# EasyEDA Pro project stm32_basic_extender.epro.epro

# Schematic Schematic1
Board Name: Board1; Create Date: 2024-08-31; Page Size: A3
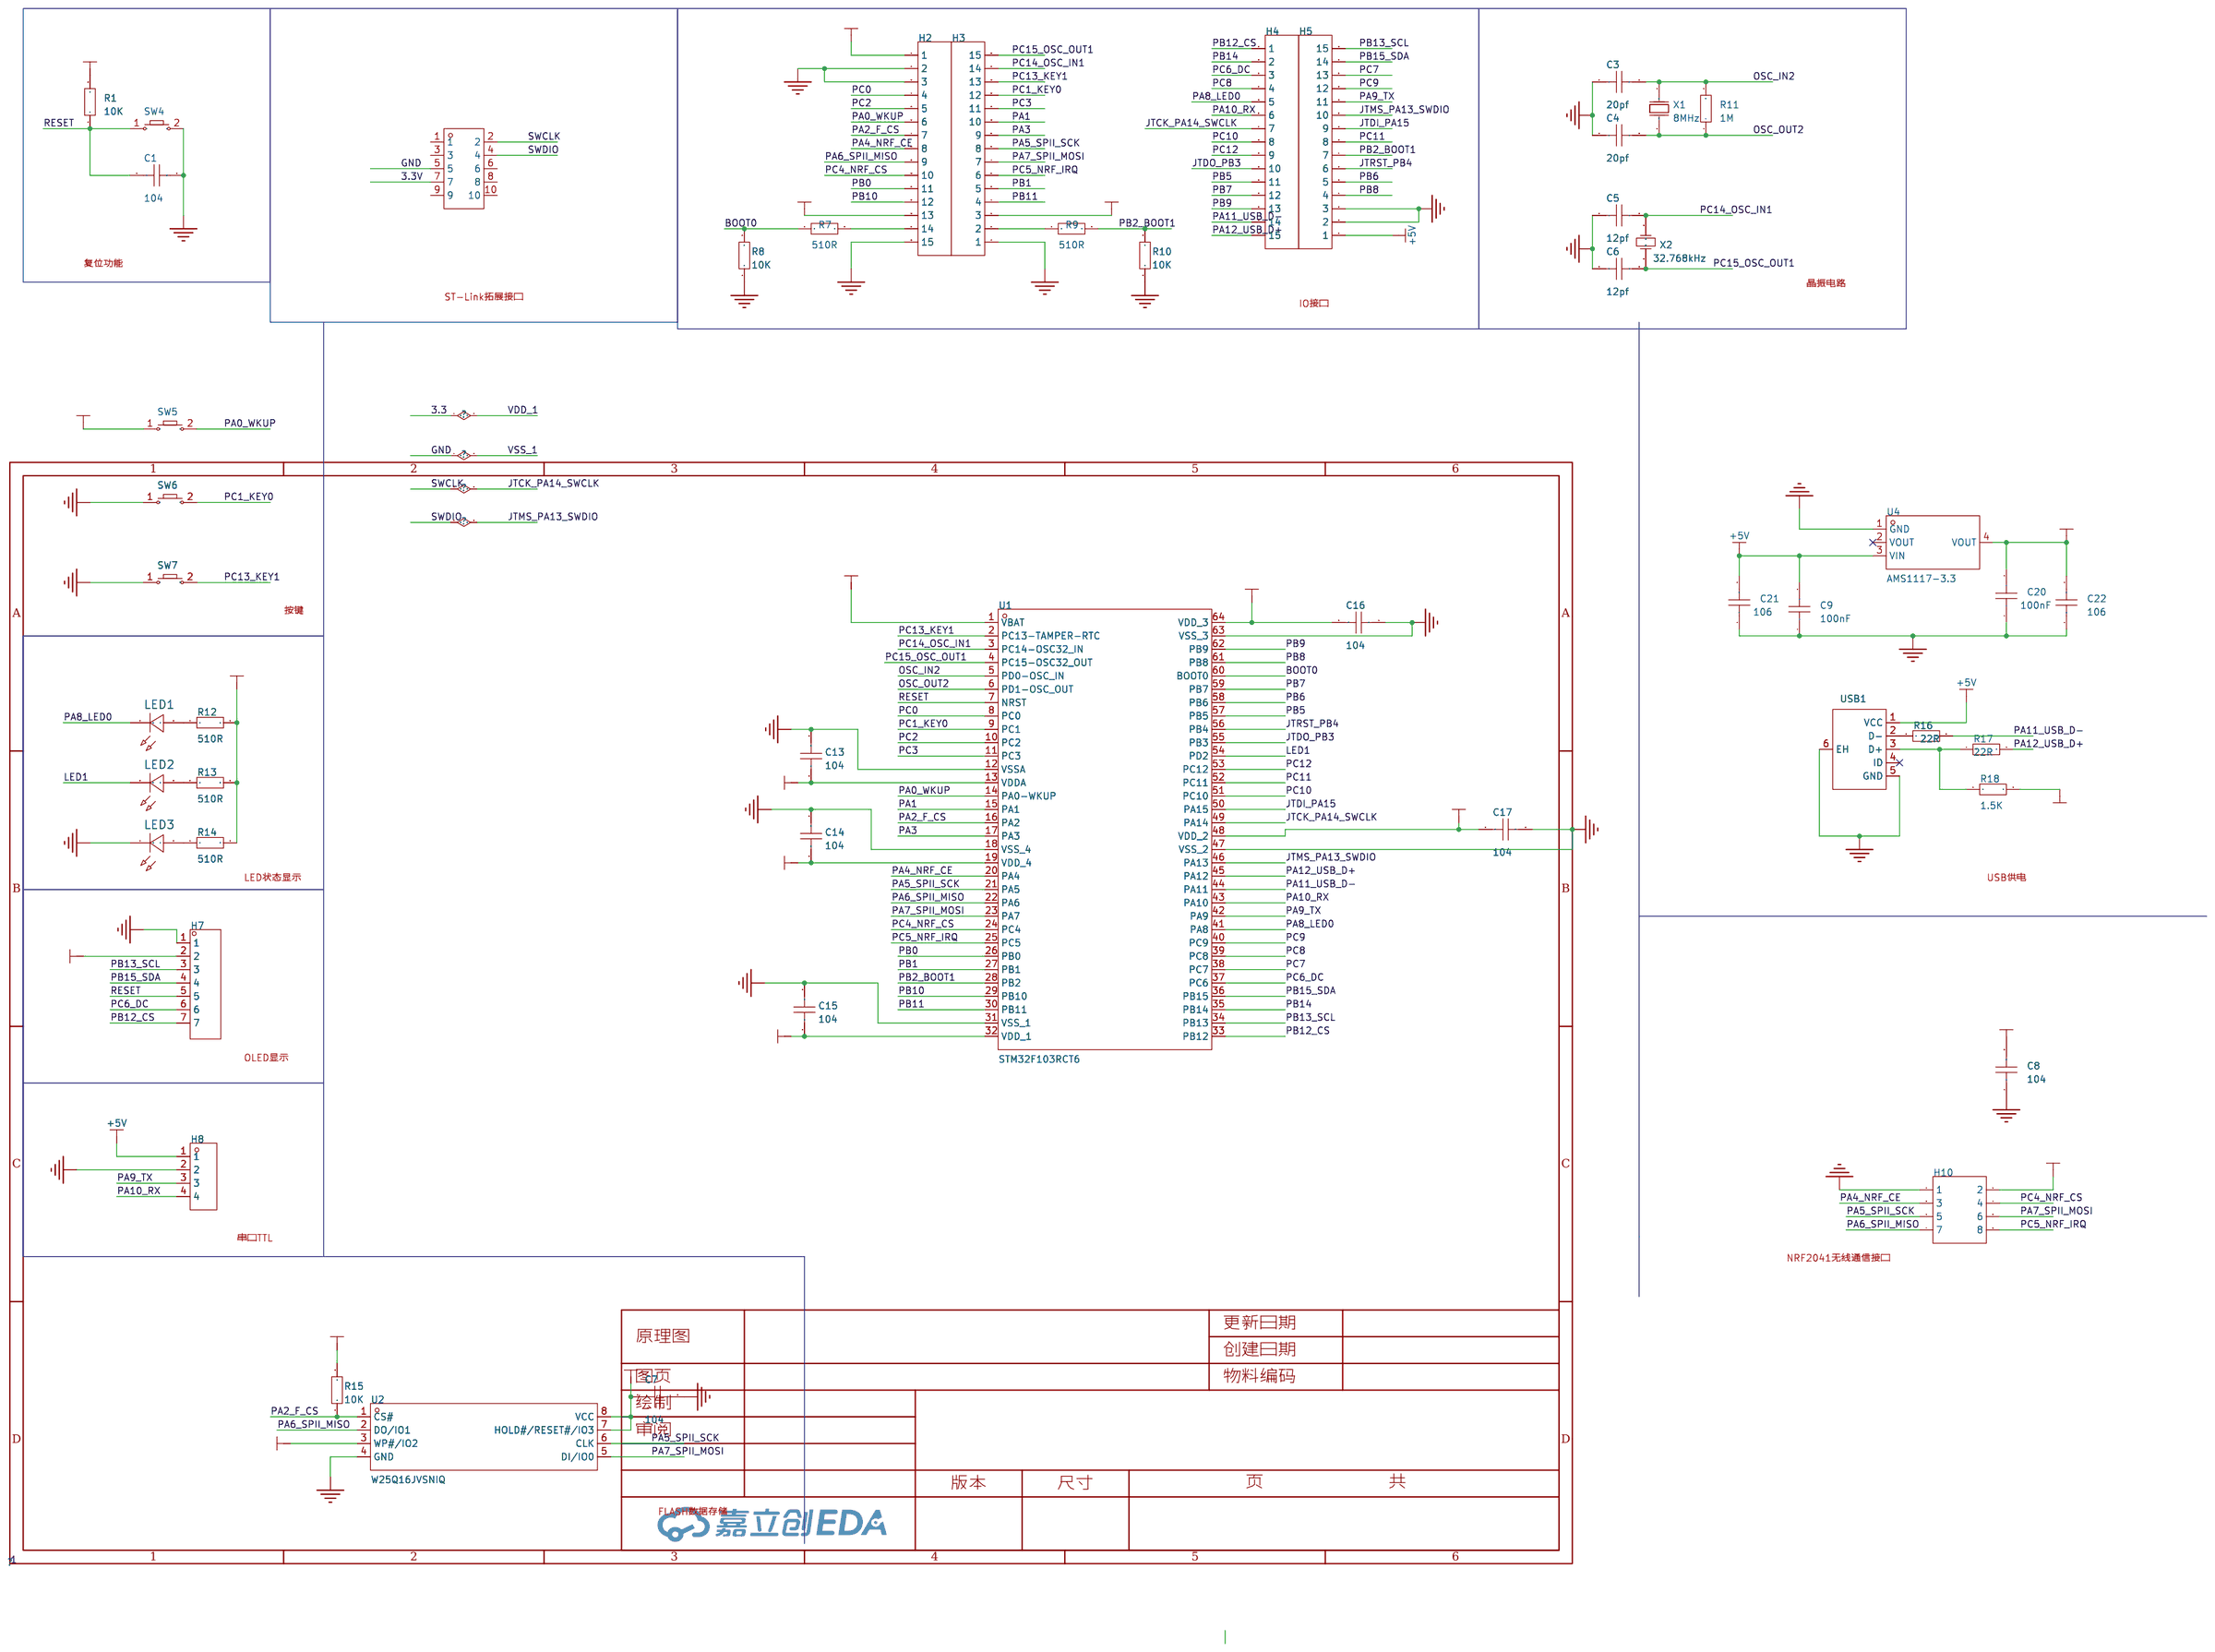
[diagram p0: schematic sheet]

## Parts
C1  104  [C0603]
C3  20pf  [C0603]
C4  20pf  [C0603]
C5  12pf  [C0603]
C6  12pf  [C0603]
C7  104  [C0603]
C8  104  [C0603]
C9  100nF  [C0603]
C13  104  [C0603]
C14  104  [C0603]
C15  104  [C0603]
C16  104  [C0603]
C17  104  [C0603]
C20  100nF  [C0603]
C21  106  [C0805]
C22  106  [C0805]
H2  -  [HDR-TH_15P-P2.54-V-F-1]
H3  -  [HDR-TH_15P-P2.54-V-F-1]
H4  -  [HDR-TH_15P-P2.54-V-F-1]
H5  -  [HDR-TH_15P-P2.54-V-F-1]
H7  -  [HDR-TH_7P-P2.54-V-F]
H8  -  [HDR-TH_4P-P2.54-V-F]
H10  -  [HDR-TH_8P-P2.54-V-F-R2-C4-S2.54-1]
LED1  -  [LED_0603]
LED2  -  [LED_0603]
LED3  -  [LED_0603]
R1  10K  [R0603]
R7  510R  [R0603]
R8  10K  [R0603]
R9  510R  [R0603]
R10  10K  [R0603]
R11  1M  [R0603]
R12  510R  [R0603]
R13  510R  [R0603]
R14  510R  [R0603]
R15  10K  [R0603]
R16  22R  [R0603]
R17  22R  [R0603]
R18  1.5K  [R0603]
SW4  -  [Key_SMD_3.6x6.1x2.5]
SW5  -  [Key_SMD_3.6x6.1x2.5]
SW6  -  [Key_SMD_3.6x6.1x2.5]
SW7  -  [Key_SMD_3.6x6.1x2.5]
U1  STM32F103RCT6  [LQFP-64_L10.0-W10.0-P0.50-LS12.0-BL]
U2  W25Q16JVSNIQ  [SOIC-8_L5.2-W5.2-P1.27-LS7.9-BL]
U4  AMS1117-3.3  [SOT-223-3_L6.5-W3.4-P2.30-LS7.0-BR]
U5  2.54-2*5  [HDR-TH_10P-P2.54-V-F-R2-C5-S2.54]
USB1  -  [USB_Micro]
X1  8MHz  [OSC-TH_L10.0-W4.5-P5.00]
X2  32.768kHz  [OSC-TH_BD3.1-P0.8-D0.3]

## Library data of the parts
C1 C3-C9 C13-C17 C20 = CAP_0603: Supplier Footprint: 0603
C21 C22 = CAP_0805: Supplier Footprint: 0805
H2-H5 = HDR-F_2.54_1x15P: Supplier Part: C124408; Supplier Footprint: 插件,
H7 = HDR-F_2.54_1x7P: Supplier Part: C124418; Supplier Footprint: 插件
H8 = HDR-F_2.54_1x4P: Supplier Part: C2718488; Supplier Footprint: 插件
H10 = HDR-F_2.54_2x4: Supplier Part: C92271; Supplier Footprint: 插件
LED1-LED3 = LED_0603-R: Supplier Footprint: 0603
R1 R7-R18 = Res_0603: Supplier Footprint: 0603
SW4-SW7 = Key_SMD_3.6x6.1x2.5: Supplier Footprint: SMD
U1 = STM32F103RCT6: CPU内核:ARM-M3;程序存储容量:256KB;RAM总容量:48KB;GPIO端口数量:51;工作电压范围:2V~3.6V;CPU最大主频:72MHz;程序存储器类型:FLASH;; LCSC Part Name: 主流增强型ARM Cortex-M3 MCU，具有256 KB Flash、72 MHz CPU、电机控制、USB和CAN; Supplier Part: C8323; Manufacturer: ST(意法半导体); Supplier Footprint: LQFP-64(10x10); JLCPCB Part Class: 扩展库; Datasheet: https://atta.szlcsc.com/upload/public/pdf/source/20180207/C88442_15179953708671359491.pdf; Supplier: LCSC; CPU Core: ARM-M3; Program Storage Size: 256KB; RAM Size: 48KB; GPIO Ports Number: 51; Operating Voltage Range: 2V~3.6V; CPU Maximum Speed: 72MHz; Program Memory Type: FLASH; Operating Temperature Range: -40℃~+85℃; ADC (Bit): 12bit; DAC (Bit): 12bit; Universal Serial Bus: 有; Peripheral/Function: DMA；温度传感器；PWM; Watchdog: 有; Infrared Data Association: 有; Low-Voltage Detect: 有; Direct Memory Access: 有; Internal Oscillator: 有; EEPROM: 256KB
U2 = W25Q16JVSNIQ_C2456211: Supplier Part: C2456211; Manufacturer: WINBOND(华邦); Supplier Footprint: SOIC-8; JLCPCB Part Class: Extended Part; Datasheet: https://atta.szlcsc.com/upload/public/pdf/source/20190529/C115407_78E5B4F96E7138D299EC51EC5982A1A5.pdf; Supplier: LCSC
U4 = AMS1117-3.3_C6186: 输出类型:固定;输出极性:正;最大输入电压:-;输出电压:3.3V;输出电流:1A;电源纹波抑制比(PSRR):72dB@(120Hz);; LCSC Part Name: 输出3.3V 1A; Supplier Part: C6186; Manufacturer: AMS; Supplier Footprint: SOT-223; JLCPCB Part Class: 基础库; Datasheet: https://atta.szlcsc.com/upload/public/pdf/source/20180727/C6186_7A095716F0823C02F1997A905E26C086.pdf; Supplier: LCSC; Output Type: 固定; Output Polarity: 正; Number of Outputs: 1; Output Voltage: 3.3V; Dropout Voltage: 1.3V@(800mA); Output Current: 1A; Power Supply Rejection Ratio (PSRR): 72dB@(120Hz)
U5 = 2.54-2*5: 插孔结构:2x5P;间距:2.54mm;行距:2.54mm;圆孔/方孔:方孔;安装类型:直插;排数:双排;总孔位数:10P;额定电流:2.5A;额定电压:-;插孔方向:顶部;塑高:8.5mm;工作温度范围:-40℃~+105℃;; LCSC Part Name: 间距:2.54mm 2x5P 直插; Supplier Part: C2977587; Manufacturer: ZHOURI(洲日); Supplier Footprint: 插件,P=2.54mm; JLCPCB Part Class: 扩展库; Datasheet: https://atta.szlcsc.com/upload/public/pdf/source/20220328/53961E697C4FF664B69BABFADEC8B830.pdf; Supplier: LCSC; Holes Structure: 2x5P; Pitch: 2.54mm; Row Spacing: 2.54mm; Circular Hole / Square Hole: 方孔; Mounting Type: 直插; Number of Rows: 双排; Number of Holes: 10P; Current Rating (Max): 2.5A; Holes Direction: 顶部; Insulation Height: 8.5mm; Operating Temperature Range: -40℃~+105℃
USB1 = USB_Micro-B: Supplier Footprint: SMD
X1 = X49SD8MSD2SC: 频率:8MHz;频率公差:±20ppm;负载电容:20pF;; LCSC Part Name: 8MHz ±20ppm 20pF HC-49US; Supplier Part: C21263; Manufacturer: YXC(扬兴晶振); Supplier Footprint: HC-49S; JLCPCB Part Class: Extended Part; Datasheet: https://atta.szlcsc.com/upload/public/pdf/source/20210903/A997D130AE99CBB55D9024F9BE6DA174.pdf; Supplier: LCSC; Crystal Type: 49S晶振; Frequency Tolerance: ±20ppm; Frequency Stability: ±30ppm; Load Capacitance: 20pF; Operating Temperature: -20℃~+70℃
X2 = X308032768KGB2SC: 频率:32.768kHz;频率公差:±10ppm;负载电容:12.5pF;; LCSC Part Name: 32.768kHz ±10ppm 12.5pF YT-38; Supplier Part: C52082; Manufacturer: YXC(扬兴晶振); Supplier Footprint: DT-38; JLCPCB Part Class: Extended Part; Datasheet: https://atta.szlcsc.com/upload/public/pdf/source/20210729/394323D37097DADF5DA3ECA9C1DCF4BF.pdf; Supplier: LCSC; Crystal Type: 圆柱体晶振; Frequency Tolerance: ±10ppm; Load Capacitance: 12.5pF; Operating Temperature: -20℃~+70℃

## Nets
3.3V: U5.7
+5V: C9.2 C21.2 H5.1 H8.1 U4.3(VIN) USB1.1(VCC)
GND: C1.2 C3.1 C4.1 C5.1 C6.1 C7.2 C8.1 C9.1 C13.2 C14.2 C15.2 C16.1 C17.1 C20.1 C21.1 C22.1 H2.2 H2.3 H2.15 H3.1 H5.2 H5.3 H7.1 H8.2 H10.1 LED3.1(C) R8.1 R10.1 SW4.2 SW6.1 SW7.1 U1.12(VSSA) U1.18(VSS_4) U1.31(VSS_1) U1.47(VSS_2) U1.63(VSS_3) U2.4(GND) U4.1(GND) U5.5 USB1.5(GND) USB1.6(EH)
VCC3V3: C7.1 C8.2 C13.1 C14.1 C15.1 C16.2 C17.2 C20.2 C22.2 H2.1 H2.13 H3.3 H7.2 H10.2 R1.2 R12.2 R13.2 R14.2 R15.2 R18.2 SW5.1 U1.1(VBAT) U1.13(VDDA) U1.19(VDD_4) U1.32(VDD_1) U1.48(VDD_2) U1.64(VDD_3) U2.3(WP#/IO2) U2.7(HOLD#/RESET#/IO3) U2.8(VCC) U4.4(VOUT)
BOOT0: R7.1 R8.2 U1.60(BOOT0)
JTCK_PA14_SWCLK: H4.7 U1.49(PA14) U5.2
JTDI_PA15: H5.9 U1.50(PA15)
JTDO_PB3: H4.10 U1.55(PB3)
JTMS_PA13_SWDIO: H5.10 U1.46(PA13) U5.4
JTRST_PB4: H5.6 U1.56(PB4)
LED1: LED2.1(C) U1.54(PD2)
OSC_IN2: C3.2 R11.2 U1.5(PD0-OSC_IN) X1.1(OSC1)
OSC_OUT2: C4.2 R11.1 U1.6(PD1-OSC_OUT) X1.2(OSC2)
PA0_WKUP: H2.6 SW5.2 U1.14(PA0-WKUP)
PA1: H3.10 U1.15(PA1)
PA2_F_CS: H2.7 R15.1 U1.16(PA2) U2.1(CS#)
PA3: H3.9 U1.17(PA3)
PA4_NRF_CE: H2.8 H10.3 U1.20(PA4)
PA5_SPII_SCK: H3.8 H10.5 U1.21(PA5) U2.6(CLK)
PA6_SPII_MISO: H2.9 H10.7 U1.22(PA6) U2.2(DO/IO1)
PA7_SPII_MOSI: H3.7 H10.6 U1.23(PA7) U2.5(DI/IO0)
PA8_LED0: H4.5 LED1.1(C) U1.41(PA8)
PA9_TX: H5.11 H8.3 U1.42(PA9)
PA10_RX: H4.6 H8.4 U1.43(PA10)
PA11_USB_D-: H4.14 R16.2 U1.44(PA11)
PA12_USB_D+: H4.15 R17.2 U1.45(PA12)
PB0: H2.11 U1.26(PB0)
PB1: H3.5 U1.27(PB1)
PB2_BOOT1: H5.7 R9.2 R10.2 U1.28(PB2)
PB5: H4.11 U1.57(PB5)
PB6: H5.5 U1.58(PB6)
PB7: H4.12 U1.59(PB7)
PB8: H5.4 U1.61(PB8)
PB9: H4.13 U1.62(PB9)
PB10: H2.12 U1.29(PB10)
PB11: H3.4 U1.30(PB11)
PB12_CS: H4.1 H7.7 U1.33(PB12)
PB13_SCL: H5.15 H7.3 U1.34(PB13)
PB14: H4.2 U1.35(PB14)
PB15_SDA: H5.14 H7.4 U1.36(PB15)
PC0: H2.4 U1.8(PC0)
PC1_KEY0: H3.12 SW6.2 U1.9(PC1)
PC2: H2.5 U1.10(PC2)
PC3: H3.11 U1.11(PC3)
PC4_NRF_CS: H2.10 H10.4 U1.24(PC4)
PC5_NRF_IRQ: H3.6 H10.8 U1.25(PC5)
PC6_DC: H4.3 H7.6 U1.37(PC6)
PC7: H5.13 U1.38(PC7)
PC8: H4.4 U1.39(PC8)
PC9: H5.12 U1.40(PC9)
PC10: H4.8 U1.51(PC10)
PC11: H5.8 U1.52(PC11)
PC12: H4.9 U1.53(PC12)
PC13_KEY1: H3.13 SW7.2 U1.2(PC13-TAMPER-RTC)
PC14_OSC_IN1: C5.2 H3.14 U1.3(PC14-OSC32_IN) X2.2(OSC2)
PC15_OSC_OUT1: C6.2 H3.15 U1.4(PC15-OSC32_OUT) X2.1(OSC1)
RESET: C1.1 H7.5 R1.1 SW4.1 U1.7(NRST)
Net-(H2-14): H2.14 R7.2
Net-(H3-2): H3.2 R9.1
Net-(LED1-2): LED1.2(A) R12.1
Net-(LED2-2): LED2.2(A) R13.1
Net-(LED3-2): LED3.2(A) R14.1
Net-(R16-1): R16.1 USB1.2(D-)
Net-(R17-1): R17.1 R18.1 USB1.3(D+)

Not connected (* = marked no-connect by the designer): U4 2(VOUT)*; U5 1 3 6 8 9 10; USB1 4(ID)*

## Notes on the sheet
- 复位功能
- 晶振电路
- ST-Link拓展接口
- IO接口
- 按键
- LED状态显示
- USB供电
- OLED显示
- 串口TTL
- NRF2041无线通信接口
- FLASH数据存储
